# EAGLE design teensy_sync_rev1 (EAGLE 7.7.0)
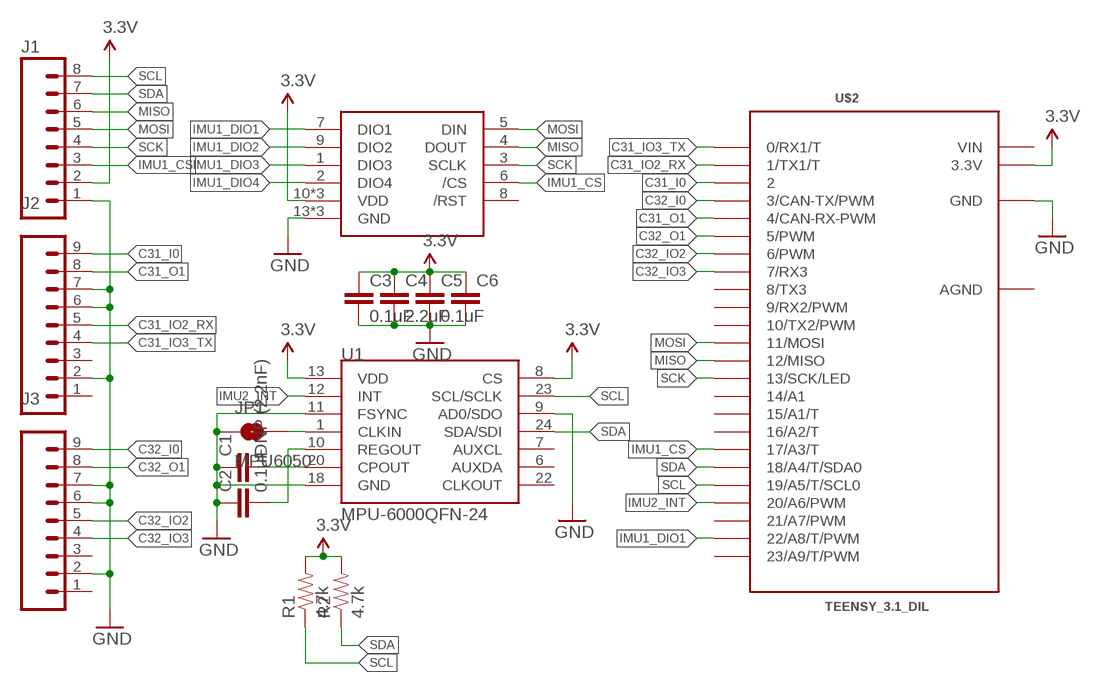
[diagram p0: schematic, sheet 1]

## Parts
C1  DNP (2.2nF)  CAP0402-CAP  [0402-CAP]
C2  0.1uF  CAP0402-CAP  [0402-CAP]
C3  0.1uF  CAP0402-CAP  [0402-CAP]
C4  2.2uF  CAP0402-CAP  [0402-CAP]
C5  0.1uF  CAP0402-CAP  [0402-CAP]
C6  CAP0402-CAP  [0402-CAP]
J1  M08  [1X08_ROUND]
J2  M09  [1X09]
J3  M09  [1X09]
JP1  MPU6050  JUMPER-PAD-2-NOYES_SILK  [PAD-JUMPER-2-NO_YES_SILK]
R1  4.7k  RESISTOR0603  [0603-RES]
R2  4.7k  RESISTOR0603  [0603-RES]
U1  MPU-6000QFN-24  [QFN-24-TESTING]
U$1  ADIS16448  [ADIS16448]
U$2  TEENSY_3.1_DIL  [TEENSY3-DIL]

## Nets
3.3V: C3.1 C4.1 C5.1 C6.1 J1.2 R1.2 R2.2 U1.8(CS) U1.13(VDD) U$1.10(VDD) U$1.11(VDD) U$1.12(VDD) U$2.3.3V
C31_I0: J2.9 U$2.2
C31_IO2_RX: J2.5 U$2.1(1/TX1/T)
C31_IO3_TX: J2.4 U$2.0(0/RX1/T)
C31_O1: J2.8 U$2.4(4/CAN-RX-PWM)
C32_I0: J3.9 U$2.3(3/CAN-TX/PWM)
C32_IO2: J3.5 U$2.6(6/PWM)
C32_IO3: J3.4 U$2.7(7/RX3)
C32_O1: J3.8 U$2.5(5/PWM)
GND: C1.1 C2.1 C3.2 C4.2 C5.2 C6.2 J1.1 J2.2 J2.6 J2.7 J3.2 J3.6 J3.7 JP1.1 U1.9(AD0/SDO) U1.11(FSYNC) U1.18(GND) U$1.13(GND) U$1.14(GND) U$1.15(GND) U$2.GND
IMU1_CS: J1.3 U$1.6(/CS) U$2.17/A3(17/A3/T)
IMU1_DIO1: U$1.7(DIO1) U$2.22/A8(22/A8/T/PWM)
IMU1_DIO2: U$1.9(DIO2)
IMU1_DIO3: U$1.1(DIO3)
IMU1_DIO4: U$1.2(DIO4)
IMU2_INT: U1.12(INT) U$2.20/A6(20/A6/PWM)
MISO: J1.6 U$1.4(DOUT) U$2.12(12/MISO)
MOSI: J1.5 U$1.5(DIN) U$2.11(11/MOSI)
N$7: C1.2 U1.20(CPOUT)
N$8: JP1.2 U1.1(CLKIN)
REGOUT: C2.2 U1.10(REGOUT)
SCK: J1.4 U$1.3(SCLK) U$2.13(13/SCK/LED)
SCL: J1.8 R1.1 U1.23(SCL/SCLK) U$2.19/A5(19/A5/T/SCL0)
SDA: J1.7 R2.1 U1.24(SDA/SDI) U$2.18/A4(18/A4/T/SDA0)
Unconnected: J2.1 J2.3 J3.1 J3.3 U1.6(AUXDA) U1.7(AUXCL) U1.22(CLKOUT) U$1.8(/RST) U$2.8(8/TX3) U$2.9(9/RX2/PWM) U$2.10(10/TX2/PWM) U$2.14/A0(14/A1) U$2.15/A1(15/A1/T) U$2.16/A2(16/A2/T) U$2.21/A7(21/A7/PWM) U$2.23/A9(23/A9/T/PWM)

## Power pins joined to a net without a drawn wire
AGND: U$2.AGND
VIN: U$2.VIN

## Library data of the parts
C1-C6 = SparkFun-Capacitors:CAP: Capacitor Standard 0603 ceramic capacitor, and 0.1" leaded capacitor.
J1 = SparkFun-Connectors:M08: Header 8 Standard 8-pin 0.1" header. Use with straight break away headers (SKU : PRT-00116), right angle break away headers (PRT-00553), swiss pins (PRT-00743), machine pins (PRT-00117), and female headers (PRT-00115).; PROD_ID: CONN-08437
J2 J3 = SparkFun-Connectors:M09: Header 9 Standard 9-pin 0.1" header. Use with straight break away headers (SKU : PRT-00116), right angle break away headers (PRT-00553), swiss pins (PRT-00743), machine pins (PRT-00117), and female headers (PRT-00115).
JP1 = SparkFun-Passives:JUMPER-PAD-2-NO
R1 R2 = SparkFun-Resistors:RESISTOR: Resistor Basic schematic elements and footprints for 0603, 1206, and PTH resistors.
U1 = SparkFun-Sensors:MPU-6000: MPU-6000 - I2C address is 0x68 with AD0 low and 0x69 with AD0 high.
U$1 = custom:ADIS16448
U$2 = Teensy_3_and_LC_Series_Boards_v1.1:TEENSY_3.1_DIL: Teensy 3.1 or 3.2 in a DIL Layout.

## Board
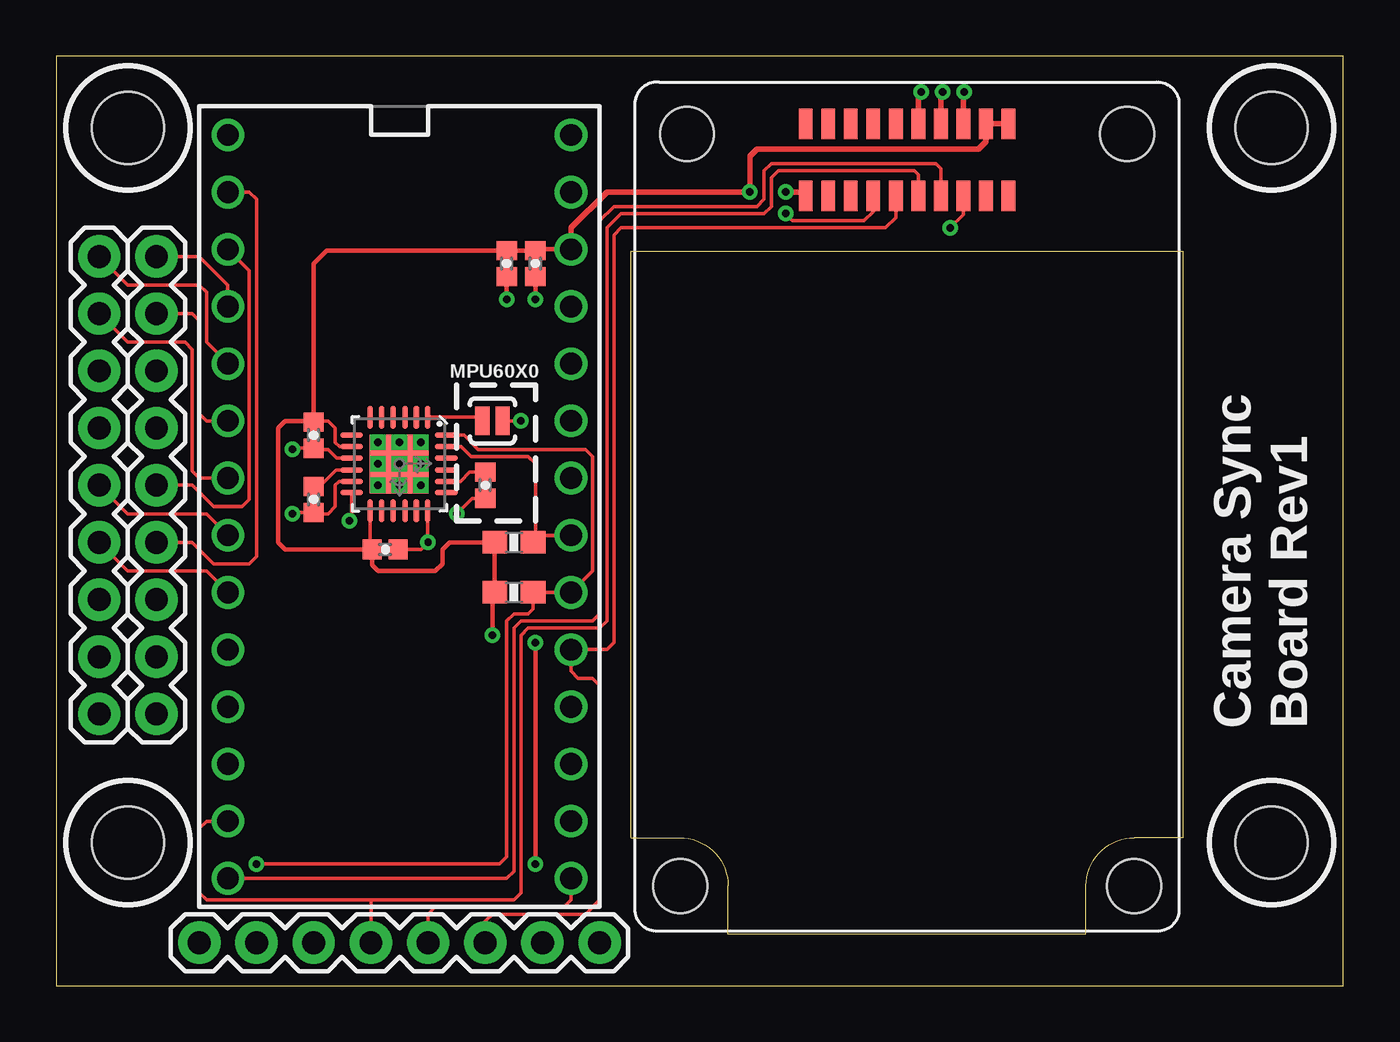
[diagram p1: board, top side]
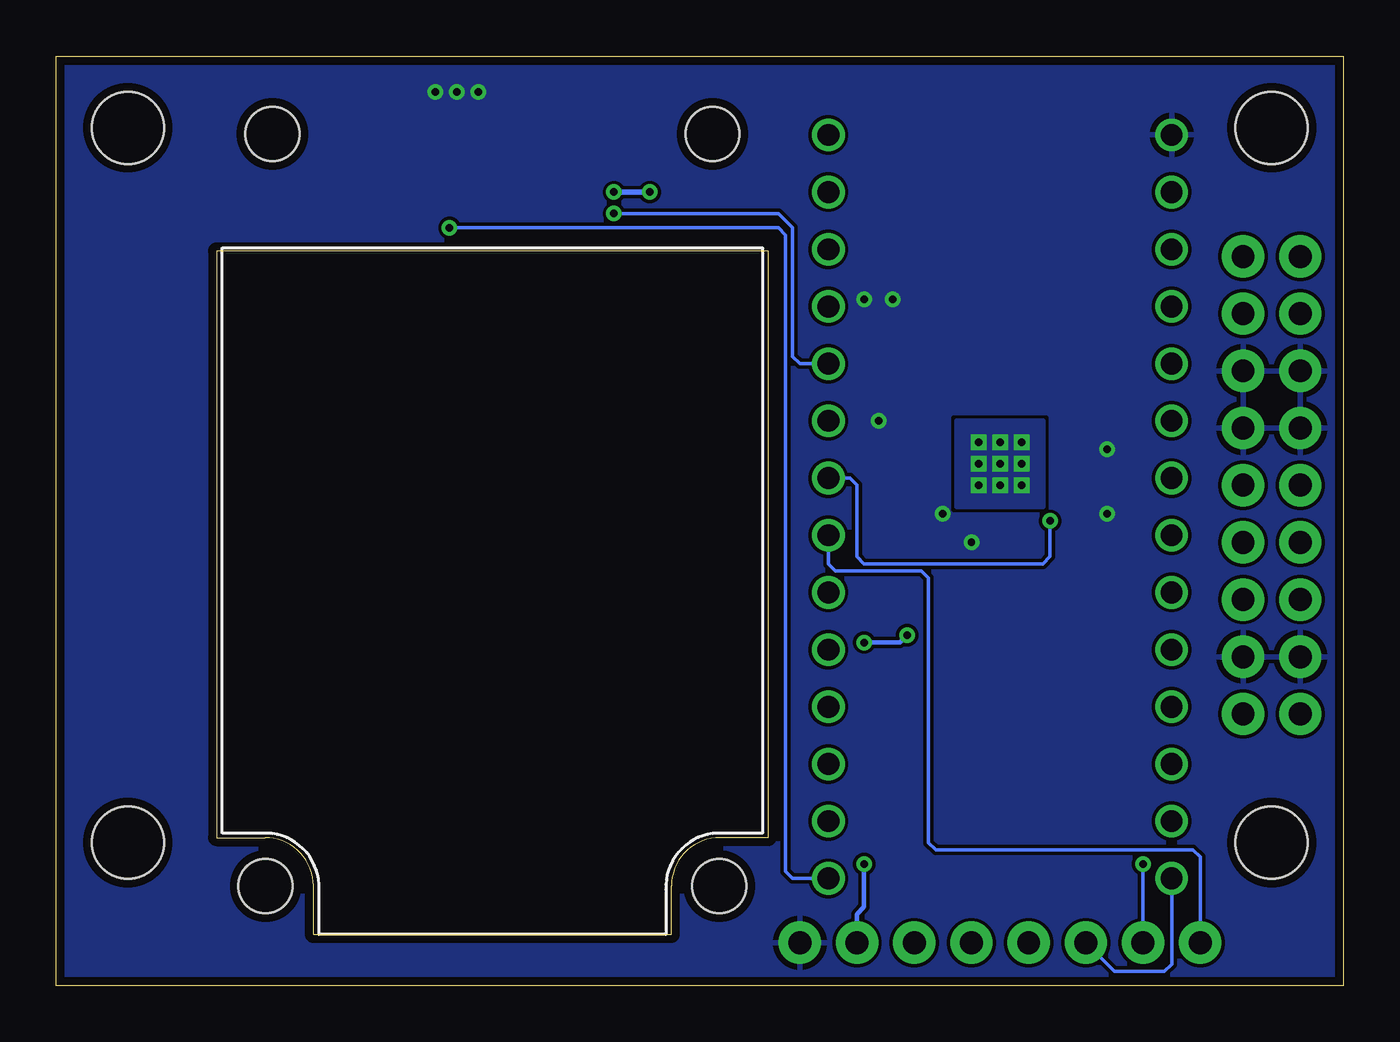
[diagram p2: board, bottom side, seen from below]

Size 57.15 x 41.27 mm. Coordinates in mm from the lower left corner, seen from the top.
Outline: 0,41.27 0,0 57.15,0 57.15,41.27 0,41.27
Copper layers (1*16): Top 0.0356mm / dielectric 1.5011mm / Bottom 0.0356mm
Design rules "oshpark-2layer": minimum track width 6mil, minimum drill 13mil, track to track 6mil, track to pad 6mil, pad to pad 6mil, via to via 6mil, smd to smd 6mil, copper to edge 15mil, drill to drill 6mil, minimum pad ring 7mil, minimum via ring 7mil, stop-mask expansion 2.5mil, vias tented up to drill 0mil, thermal gap 10mil
Holes 3.2 mm at 3.17,6.35 3.17,38.1 53.98,38.1 53.98,6.35

### Footprints (pad centres in the part's own frame; a part is rotated, then mirrored left to right if it is on the bottom)
0402-CAP = smd 0.85 x 0.9: 1 -0.58,0; 2 0.58,0
1X08_ROUND = drill 1.016 pad 1.88: 1 0,0; 2 2.54,0; 3 5.08,0; 4 7.62,0; 5 10.16,0; 6 12.7,0; 7 15.24,0; 8 17.78,0
1X09 = drill 1.016 pad 1.88: 1 0,0; 2 2.54,0; 3 5.08,0; 4 7.62,0; 5 10.16,0; 6 12.7,0; 7 15.24,0; 8 17.78,0; 9 20.32,0
PAD-JUMPER-2-NO_YES_SILK = smd 0.635 x 1.27: 1 -0.45,0; 2 0.45,0
0603-RES = smd 1.1 x 1: 1 -0.85,0; 2 0.85,0
QFN-24-TESTING = smd 1.016 x 0.254: 1 -2.066,1.257; 2 -2.066,0.75; 3 -2.066,0.247; 4 -2.066,-0.287; 5 -2.066,-0.792; 6 -2.066,-1.297; 13 2.086,-1.297; 14 2.086,-0.792; 15 2.086,-0.287; 16 2.086,0.247; 17 2.086,0.75; 18 2.086,1.257 | smd 0.254 x 1.016: 7 -1.267,-2.122; 8 -0.762,-2.122; 9 -0.258,-2.122; 10 0.278,-2.122; 11 0.78,-2.122; 12 1.287,-2.122; 19 1.287,2.082; 20 0.78,2.082; 21 0.278,2.082; 22 -0.258,2.082; 23 -0.762,2.082; 24 -1.267,2.082 | smd 2.616 x 2.616: P$1 0.02,-0.01
ADIS16448 = smd 1.37 x 0.61: 1 -13.8,4.5; 2 -13.8,3.5; 3 -13.8,2.5; 4 -13.8,1.5; 5 -13.8,0.5; 6 -13.8,-0.5; 7 -13.8,-1.5; 8 -13.8,-2.5; 9 -13.8,-3.5; 10 -13.8,-4.5; 11 -17,4.5; 12 -17,3.5; 13 -17,2.5; 14 -17,1.5; 15 -17,0.5; 16 -17,-0.5; 17 -17,-1.5; 18 -17,-2.5; 19 -17,-3.5; 20 -17,-4.5 | hole 2.4: -16.55,9.775; 16.85,10.075; 16.85,-10.075; -16.55,-9.775
TEENSY3-DIL = drill 0.965: 0 -7.62,13.97; 1 -7.62,11.43; 2 -7.62,8.89; 3 -7.62,6.35; 3.3V 7.62,11.43; 4 -7.62,3.81; 5 -7.62,1.27; 6 -7.62,-1.27; 7 -7.62,-3.81; 8 -7.62,-6.35; 9 -7.62,-8.89; 10 -7.62,-11.43; 11 -7.62,-13.97; 12 -7.62,-16.51; 13 7.62,-16.51; 14/A0 7.62,-13.97; 15/A1 7.62,-11.43; 16/A2 7.62,-8.89; 17/A3 7.62,-6.35; 18/A4 7.62,-3.81; 19/A5 7.62,-1.27; 20/A6 7.62,1.27; 21/A7 7.62,3.81; 22/A8 7.62,6.35; 23/A9 7.62,8.89; AGND 7.62,13.97; GND -7.62,16.51; VIN 7.62,16.51

### Placement (x,y rotation side)
C1  19.05,22.23 90 top
C2  11.43,21.59 90 top
C3  21.27,32.07 270 top
C4  20,32.07 270 top
C5  11.43,24.45 270 top
C6  14.61,19.37 0 top
J1  24.13,1.91 180 top
J2  4.45,12.06 90 top
J3  1.91,12.06 90 top
JP1  19.37,25.08 180 top
R1  20.32,19.68 180 top
R2  20.32,17.46 180 top
U1  15.24,23.18 270 top
U$1  37.78,21.27 270 top
U$2  15.24,21.27 0 top

### Tracks (layer width: path | path; a pad name or v marks a point on that pad's centre or on a via)
3.3V  (via drill 0.33)
  Top 0.152: U1.13 13.94,19.45 C6.1 | U1.8 12.57,23.94 12.38,24.13 12.38,24.77 12.06,25.08 11.48,25.08 C5.1 | 19.37,17.36 R2.2
  Top 0.203: 11.48,25.08 10.16,25.08 9.84,24.77 9.84,19.68 10.16,19.37 C6.1 14.03,18.68 14.29,18.41 16.83,18.41 17.14,18.73 17.14,19.37 17.46,19.68 R1.2 R2.2 | U$2.3.3V 21.33,32.7 C3.1 C4.1 12.01,32.65 11.43,32.07 C5.1 | v21.27,5.4 v21.27,15.24 | v19.37,15.56 19.37,17.36
  Top 0.254: U$2.3.3V 22.86,33.66 24.45,35.24 v30.8,35.24 30.8,36.83 31.11,37.15 40.96,37.15 41.28,37.47 U$1.12 U$1.11 | v32.38,35.24 33.11,35.24 U$1.10
  Bottom 0.203: v21.27,15.24 19.68,15.24 v19.37,15.56 | v21.27,5.4 21.27,3.49 21.59,3.17 J1.2
  Bottom 0.254: v30.8,35.24 v32.38,35.24
C31_I0
  Top 0.152: J2.9 6.35,32.38 7.62,31.11 U$2.2
C31_IO2_RX
  Top 0.152: J2.5 6.03,22.23 6.99,21.27 8.26,21.27 8.57,21.59 8.57,31.75 U$2.1
C31_IO3_TX
  Top 0.152: J2.4 6.03,19.68 6.99,18.73 8.57,18.73 8.89,19.05 8.89,34.92 8.57,35.24 U$2.0
C31_O1
  Top 0.152: U$2.4 6.67,25.08 6.35,25.4 6.35,29.53 6.03,29.84 J2.8
C32_I0
  Top 0.152: U$2.3 6.67,28.57 6.67,30.8 6.35,31.11 3.17,31.11 J3.9
C32_IO2
  Top 0.152: J3.5 3.17,20.95 6.67,20.95 U$2.6
C32_IO3
  Top 0.152: J3.4 3.17,18.41 6.67,18.41 U$2.7
C32_O1
  Top 0.152: U$2.5 6.35,22.54 6.03,22.86 6.03,28.26 5.71,28.57 3.17,28.57 J3.8
GND  (via drill 0.33)
  Top 0.152: JP1.1 v20.64,25.08 | U1.9 12.44,23.43 12.06,23.81 11.48,23.81 C5.2 10.53,23.87 v10.48,23.81 | U1.18 16.5,19.67 | 16.5,19.67 16.19,19.37 C6.2 | 16.5,19.67 v16.51,19.68 | U1.11 12.55,22.4 12.38,22.23 12.38,21.27 12.06,20.95 11.48,20.95 C2.1 10.53,21.01 v10.48,20.95 | C1.1 18.47,21.64 v17.78,20.95
  Top 0.203: C4.2 v20,30.48 | C3.2 v21.27,30.48
  Top 0.254: U$1.15 38.28,39.55 v38.42,39.69 | U$1.14 39.28,39.6 v39.37,39.69 | U$1.13 40.28,39.65 v40.32,39.69
  pour Bottom (rank 2): 0,41.27 0,0 57.15,0 57.15,41.27
HS  (via drill 0.33)
  other vias: 14.29,24.13 15.24,24.13 16.19,24.13 14.29,23.18 15.24,23.18 16.19,23.18 14.29,22.23 15.24,22.23 16.19,22.23
  pour Bottom: 13.34,25.08 17.14,25.08 17.14,21.27 13.34,21.27
IMU1_CS
  Top 0.152: U$1.6 37.28,34.11 36.83,33.66 25.08,33.66 24.77,33.34 24.77,15.24 24.45,14.92 U$2.17/A3 22.86,13.97 23.18,13.65 23.81,13.65 24.13,13.34 24.13,3.81 23.5,3.17 19.37,3.17 19.05,2.86 J1.3
IMU1_DIO1  (via drill 0.33)
  Top 0.152: U$1.7 36.28,34.38 35.88,33.97 32.7,33.97 v32.38,34.29
  Bottom 0.152: v32.38,34.29 25.08,34.29 24.45,33.66 24.45,27.94 24.13,27.62 U$2.22/A8
IMU2_INT  (via drill 0.33)
  Top 0.152: U1.12 13.12,20.74 v13.02,20.64
  Bottom 0.152: v13.02,20.64 13.02,19.05 13.34,18.73 21.27,18.73 21.59,19.05 21.59,22.23 21.91,22.54 U$2.20/A6
MISO
  Top 0.152: U$2.12 20,4.76 20.32,5.08 20.32,15.88 20.64,16.19 23.81,16.19 24.13,16.51 24.13,33.97 24.77,34.61 31.11,34.61 31.43,34.92 31.43,36.2 31.75,36.51 39.05,36.51 39.28,36.28 U$1.4
  Bottom 0.152: U$2.12 7.62,0.95 7.94,0.64 10.16,0.64 J1.6
MOSI
  Top 0.152: 13.97,3.81 6.67,3.81 6.35,4.13 6.35,6.99 6.67,7.3 U$2.11 | 13.97,3.81 20.32,3.81 20.64,4.13 20.64,15.56 20.95,15.88 24.13,15.88 24.45,16.19 24.45,33.66 25.08,34.29 31.43,34.29 31.75,34.61 31.75,35.88 32.07,36.2 38.1,36.2 38.28,36.01 U$1.5 | J1.5 13.97,3.81
N$7
  Top 0.152: U1.20 17.95,22.4 18.36,22.8 C1.2
N$8
  Top 0.152: U1.1 18.76,25.24 JP1.2
REGOUT
  Top 0.152: U1.10 12.42,22.9 11.69,22.17 C2.2
SCK  (via drill 0.33)
  Top 0.152: U$1.3 40.28,34.25 v39.69,33.66 | U$2.13 22.86,3.81 22.54,3.49 16.83,3.49 16.51,3.17 J1.4
  Bottom 0.152: v39.69,33.66 25.08,33.66 24.77,33.34 24.77,5.08 24.45,4.76 U$2.13
SCL
  Top 0.152: U1.23 17.97,23.94 18.41,23.5 20.95,23.5 21.27,23.18 21.27,20.11 R1.1 21.49,20 U$2.19/A5
  Bottom 0.152: U$2.19/A5 22.86,18.73 22.54,18.41 18.73,18.41 18.41,18.1 18.41,6.35 18.1,6.03 6.67,6.03 6.35,5.71 J1.8
SDA  (via drill 0.33)
  Top 0.152: U1.24 18.1,24.44 18.73,23.81 23.5,23.81 23.81,23.5 23.81,18.41 U$2.18/A4 R2.1 21.17,16.73 20.95,16.51 20.32,16.51 20,16.19 20,5.71 19.68,5.4 v8.89,5.4
  Bottom 0.152: v8.89,5.4 J1.7

### Text on the board
tPlace: MPU60X0 | Camera Sync / Board Rev1